# Altium schematic sheet mcu_io.SchDoc: Microcontroller I/O
size A4; Author: Stefan Lüthi; Revision: 1.0; SheetNumber: 7; SheetTotal: 8
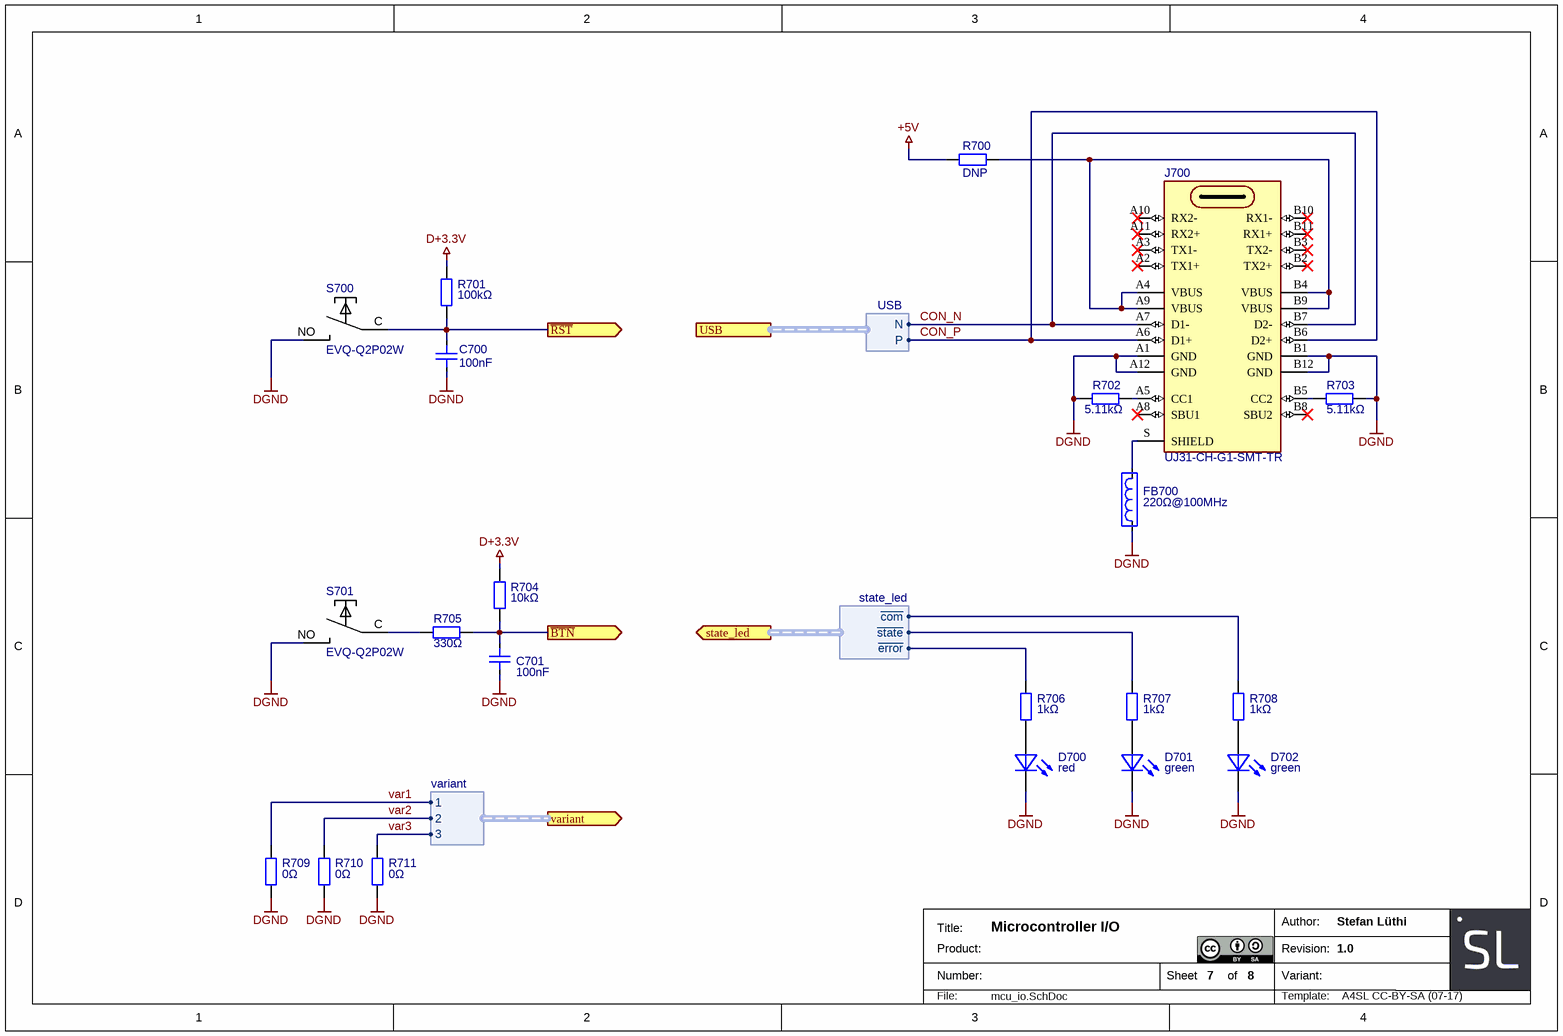
[diagram p0: mcu_io.SchDoc]

## Parts
C700  100nF  [SMD0603CAP]
C701  100nF  [SMD0603CAP]
D700  red  [SMD0603LED]
D701  green  [SMD0603LED]
D702  green  [SMD0603LED]
FB700  220Ω@100MHz  [SMD0603RES]
J700  UJ31-CH-G1-SMT-TR  [UJ31-CH-G1-SMT-TR]
R700  DNP  [SMD0603RES]
R701  100kΩ  [SMD0603RES]
R702  5.11kΩ  [SMD0603RES]
R703  5.11kΩ  [SMD0603RES]
R704  10kΩ  [SMD0603RES]
R705  330Ω  [SMD0603RES]
R706  1kΩ  [SMD0603RES]
R707  1kΩ  [SMD0603RES]
R708  1kΩ  [SMD0603RES]
R709  0Ω  [SMD0603RES]
R710  0Ω  [SMD0603RES]
R711  0Ω  [SMD0603RES]
S700  EVQ-Q2P02W  [EVQQ2]
S701  EVQ-Q2P02W  [EVQQ2]

## Ports
state_led (out, harness state_led), USB (harness USB), variant (out, harness variant), ~{BTN} (out), ~{RST} (out)

## Harnesses
USB: N, P
state_led: ~{com}, ~{state}, ~{error}
variant: 1, 2, 3

## Nets
+5V: R700.2
D+3.3V: R701.2 R704.2
DGND: C700.2 C701.2 D700.C D701.C D702.C FB700.1 J700.A1(GND) J700.A12(GND) J700.B1(GND) J700.B12(GND) R702.1 R703.1 R709.1 R710.1 R711.1 S700.NO S701.NO
~{BTN}: C701.1 R704.1 R705.1 ; port ~{BTN}
~{RST}: C700.1 R701.1 S700.C ; port ~{RST}
CON_N: J700.A7(D1-) J700.B7(D2-) ; port USB.N
CON_P: J700.A6(D1+) J700.B6(D2+) ; port USB.P
var1: R709.2 ; port variant.1
var2: R710.2 ; port variant.2
var3: R711.2 ; port variant.3
NetD700_A: D700.A R706.1
NetD701_A: D701.A R707.1
NetD702_A: D702.A R708.1
NetFB700_2: FB700.2 J700.S(SHIELD)
NetJ700_A4: J700.A4(VBUS) J700.A9(VBUS) J700.B4(VBUS) J700.B9(VBUS) R700.1
NetJ700_A5: J700.A5(CC1) R702.2
NetJ700_B5: J700.B5(CC2) R703.2
NetR705_2: R705.2 S701.C
NetR706_2: R706.2 ; port state_led.~{error}
NetR707_2: R707.2 ; port state_led.~{state}
NetR708_2: R708.2 ; port state_led.~{com}

Not connected (* = marked no-connect by the designer): J700 A2(TX1+)* A3(TX1-)* A8(SBU1)* A10(RX2-)* A11(RX2+)* B2(TX2+)* B3(TX2-)* B8(SBU2)* B10(RX1-)* B11(RX1+)*

## Notes on the sheet
- Author:
- Title:
- Number:
- Product:
- Sheet
- of
- Variant:
- Revision:
- File:
- Template:
- A4SL CC-BY-SA (07-17)

## Library data of the parts
C700 C701 = Capacitor Ceramic: Ceramic Capacitor
D700-D702 = LED
FB700 = Ferrite Bead
J700 = Connector USB C: USB Type C Jack; Manufacturer Part No.: UJ31-CH-G1-SMT-TR
R700-R711 = Resistor
S700 S701 = Button: Simple Button